# EAGLE schematic schematico- matteo (EAGLE 9.2.2)

## Sheet 1 of 3
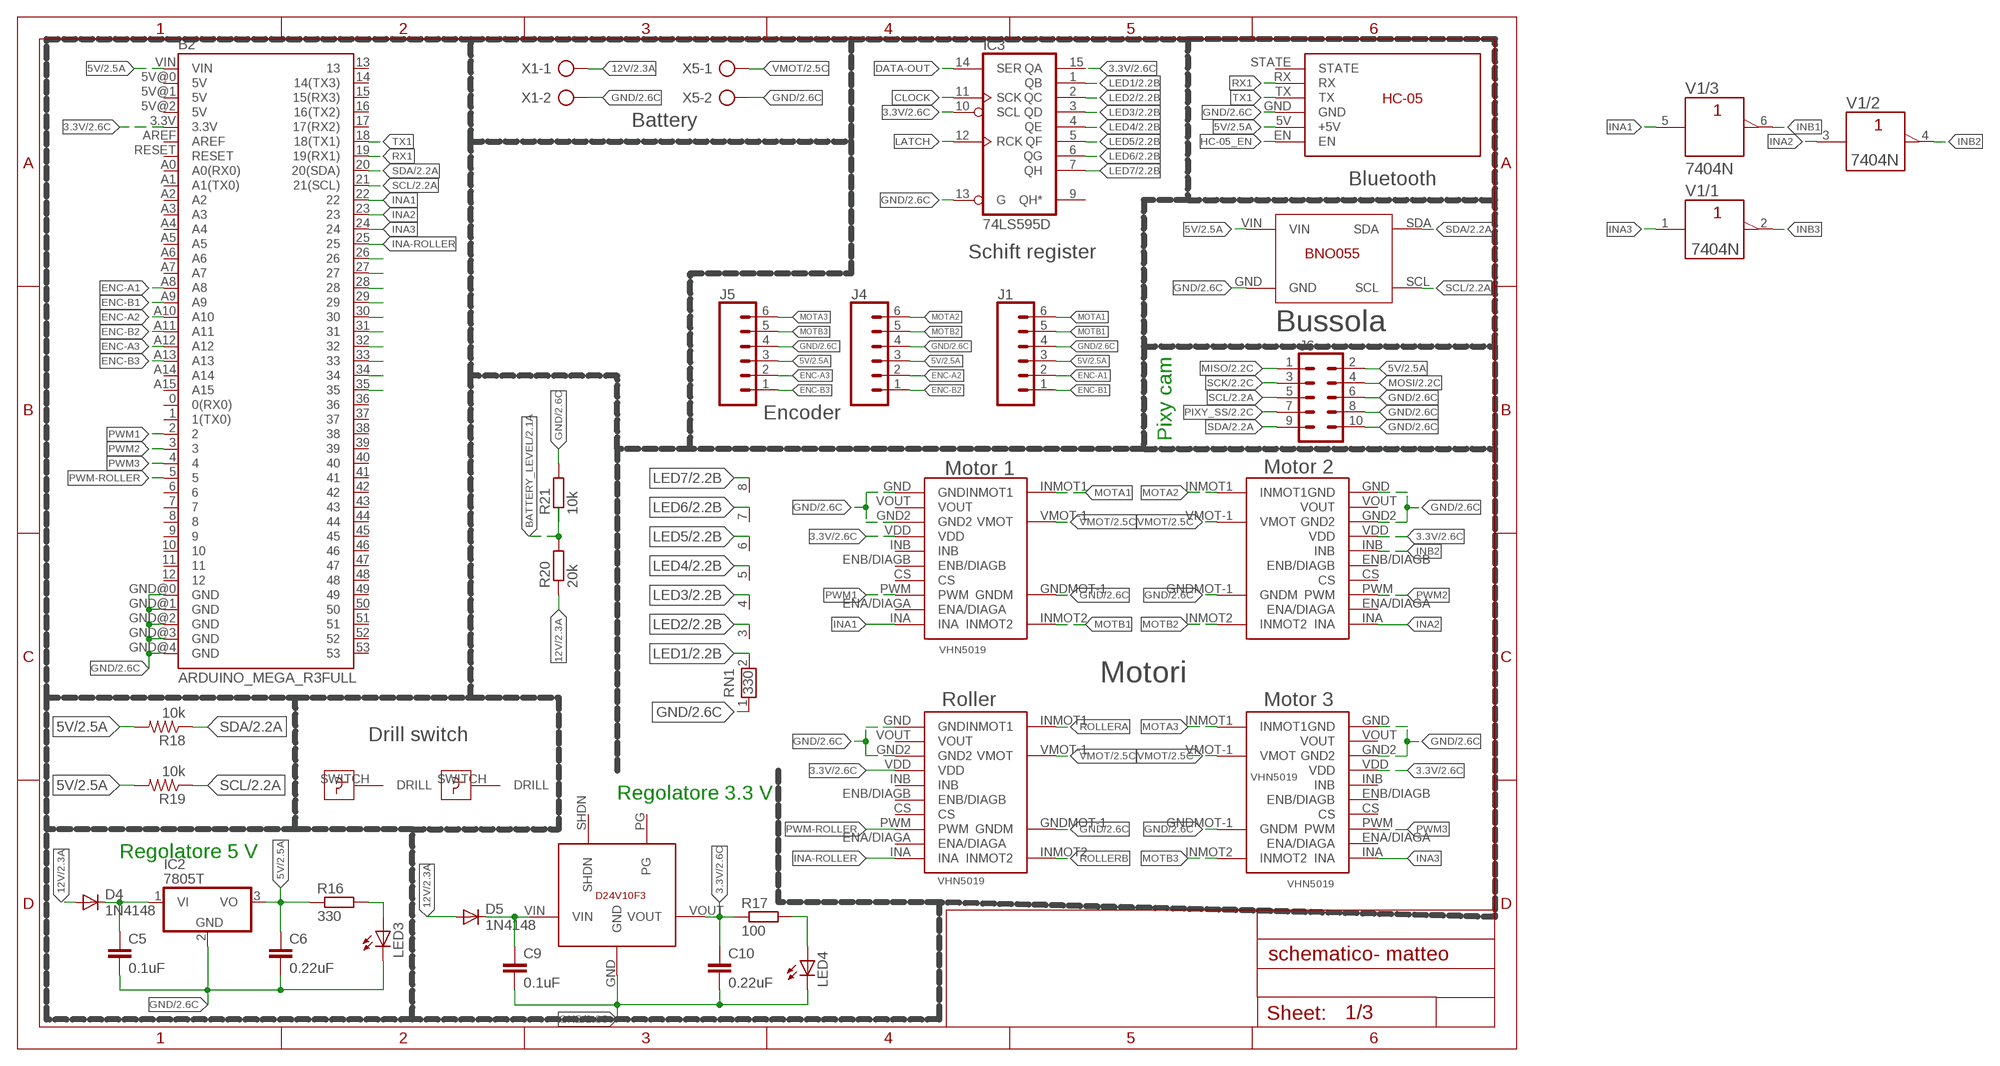
[diagram p0: schematic, sheet 1]

### Parts
B2  ARDUINO_MEGA_R3FULL  [ARDUINO_MEGA]
C5  0.1uF  0.1UF-KIT-EZ-50V-20%  [CAP-PTH-SMALL-KIT]
C6  0.22uF  0.1UF-KIT-EZ-50V-20%  [CAP-PTH-SMALL-KIT]
C9  0.1uF  0.1UF-KIT-EZ-50V-20%  [CAP-PTH-SMALL-KIT]
C10  0.22uF  0.1UF-KIT-EZ-50V-20%  [CAP-PTH-SMALL-KIT]
D4  1N4148  1N4148DO35-7  [DO35-7]
D5  1N4148  1N4148DO35-7  [DO35-7]
IC2  7805T  [TO220H]
IC3  74LS595D  [SO16]
J1  CONN_06SILK_FEMALE_PTH  [1X06]
J4  CONN_06SILK_FEMALE_PTH  [1X06]
J5  CONN_06SILK_FEMALE_PTH  [1X06]
J6  CONN_05X2PTH  [2X5]
LED3  TLLR4400  [LED3MM]
LED4  TLLR4400  [LED3MM]
R16  330  R0204/7  [0204/7]
R17  100  R0204/7  [0204/7]
R18  10k  R-US_M1206  [M1206]
R19  10k  R-US_M1206  [M1206]
R20  20k  R0204/7  [0204/7]
R21  10k  R0204/7  [0204/7]
RN1  330  RN07  [RN-8]
U$1  DRILL_SWITCH  [DRILL_SWITCH]
U$2  DRILL_SWITCH  [DRILL_SWITCH]
U$4  VHN5019  [MOTOR-SHIELD]
U$5  VHN5019  [MOTOR-SHIELD]
U$6  VHN5019  [MOTOR-SHIELD]
U$7  VHN5019  [MOTOR-SHIELD]
U$17  BNO055  [BNO005]
U$18  HC-05  [HC-05]
U$19  STEPDOWN_D24V10F3  [STEPDOWN_D24V10F3]
V1  7404N  [DIL14]
X1  AK500/2-H  [AK500/2-H]
X5  AK500/2-H  [AK500/2-H]

### Nets
3.3V: B2.3.3V C10.1 IC3.10(SCL) IC3.15(QA) R17.1 U$4.VDD U$5.VDD U$6.VDD U$7.VDD U$19.VOUT ; also sheet 2,3
5V: B2.VIN C6.1 IC2.3(VO) J1.3 J4.3 J5.3 J6.2 R16.1 R18.2 R19.2 U$17.VIN U$18.5V(+5V) ; also sheet 2,3
12V: C5.1 D4.A D4.C D5.A IC2.1(VI) R20.1 X1.1 ; also sheet 2,3
BATTERY_LEVEL: R20.2 R21.1 ; also sheet 2,3
CLOCK: IC3.11(SCK)
DATA-OUT: IC3.14(SER)
ENC-A1: B2.A8 J1.2
ENC-A2: B2.A10 J4.2
ENC-A3: B2.A12 J5.2
ENC-B1: B2.A9 J1.1
ENC-B2: B2.A11 J4.1
ENC-B3: B2.A13 J5.1
GND: B2.GND@0(GND) B2.GND@1(GND) B2.GND@2(GND) B2.GND@3(GND) B2.GND@4(GND) C5.2 C6.2 C9.2 C10.2 IC2.2(GND) IC3.13(G) J1.4 J4.4 J5.4 J6.6 J6.8 J6.10 LED3.K(C) LED4.K(C) R21.2 RN1.1 U$4.GND U$4.GND2 U$4.GNDMOT-1(GNDM) U$5.GND U$5.GND2 U$5.GNDMOT-1(GNDM) U$6.GND U$6.GND2 U$6.GNDMOT-1(GNDM) U$7.GND U$7.GND2 U$7.GNDMOT-1(GNDM) U$17.GND U$18.GND U$19.GND X1.2 X5.2 ; also sheet 2,3
HC-05_EN: U$18.EN
INA1: B2.22 U$4.INA V1.5(/3:A)
INA2: B2.23 U$5.INA V1.3(/2:A)
INA3: B2.24 U$6.INA V1.1(/1:A)
INA-ROLLER: B2.25 U$7.INA
INB1: V1.6(/3:Y)
INB2: U$5.INB V1.4(/2:Y)
INB3: V1.2(/1:Y)
LATCH: IC3.12(RCK)
LED1: IC3.1(QB) RN1.2 ; also sheet 2,3
LED2: IC3.2(QC) RN1.3 ; also sheet 2,3
LED3: IC3.3(QD) RN1.4 ; also sheet 2,3
LED4: IC3.4(QE) RN1.5 ; also sheet 2,3
LED5: IC3.5(QF) RN1.6 ; also sheet 2,3
LED6: IC3.6(QG) RN1.7 ; also sheet 2,3
LED7: IC3.7(QH) RN1.8 ; also sheet 2,3
MISO: J6.1 ; also sheet 2,3
MOSI: J6.4 ; also sheet 2,3
MOTA1: J1.6 U$4.INMOT1
MOTA2: J4.6 U$5.INMOT1
MOTA3: J5.6 U$6.INMOT1
MOTB1: J1.5 U$4.INMOT2
MOTB2: J4.5 U$5.INMOT2
MOTB3: J5.5 U$6.INMOT2
N$1: LED3.A R16.2
N$6: C9.1 D5.C U$19.VIN
N$7: B2.26
N$21: LED4.A R17.2
N$22: B2.27
N$26: B2.28
N$27: B2.29
N$28: B2.30
N$29: B2.31
N$30: B2.32
N$31: B2.33
N$32: B2.34
N$33: B2.35
PIXY_SS: J6.7 ; also sheet 2,3
PWM1: B2.2 U$4.PWM
PWM2: B2.3 U$5.PWM
PWM3: B2.4 U$6.PWM
PWM-ROLLER: B2.5 U$7.PWM
ROLLERA: U$7.INMOT1
ROLLERB: U$7.INMOT2
RX1: B2.19(19(RX1)) U$18.RX
SCK: J6.3 ; also sheet 2,3
SCL: B2.21(21(SCL)) J6.5 R19.1 U$17.SCL ; also sheet 2,3
SDA: B2.20(20(SDA)) J6.9 R18.1 U$17.SDA ; also sheet 2,3
TX1: B2.18(18(TX1)) U$18.TX
VMOT: U$4.VMOT-1(VMOT) U$5.VMOT-1(VMOT) U$6.VMOT-1(VMOT) U$7.VMOT-1(VMOT) X5.1 ; also sheet 2,3
Unconnected: B2.0(0(RX0)) B2.1(1(TX0)) B2.5V@0(5V) B2.5V@1(5V) B2.5V@2(5V) B2.6 B2.7 B2.8 B2.9 B2.10 B2.11 B2.12 B2.13 B2.14(14(TX3)) B2.15(15(RX3)) B2.16(16(TX2)) B2.17(17(RX2)) B2.36 B2.37 B2.38 B2.39 B2.40 B2.41 B2.42 B2.43 B2.44 B2.45 B2.46 B2.47 B2.48 B2.49 B2.50 B2.51 B2.52 B2.53 B2.A0(A0(RX0)) B2.A1(A1(TX0)) B2.A2 B2.A3 B2.A4 B2.A5 B2.A6 B2.A7 B2.A14 B2.A15 B2.AREF B2.RESET IC3.9(QH*) U$1.SWITCH(DRILL) U$2.SWITCH(DRILL) U$4.CS U$4.ENA/DIAGA U$4.ENB/DIAGB U$4.INB U$4.VOUT U$5.CS U$5.ENA/DIAGA U$5.ENB/DIAGB U$5.VOUT U$6.CS U$6.ENA/DIAGA U$6.ENB/DIAGB U$6.INB U$6.VOUT U$7.CS U$7.ENA/DIAGA U$7.ENB/DIAGB U$7.INB U$7.VOUT U$18.STATE U$19.PG U$19.SHDN V1.8(/4:Y) V1.9(/4:A) V1.10(/5:Y) V1.11(/5:A) V1.12(/6:Y) V1.13(/6:A)

### Notes on the sheet
- Battery
- Bluetooth
- Schift register
- Bussola
- Pixy cam
- Encoder
- Motor 1 | Motor 2
- Motori
- Roller | Motor 3
- Drill switch
- Regolatore 3.3 V
- Regolatore 5 V

## Sheet 2 of 3
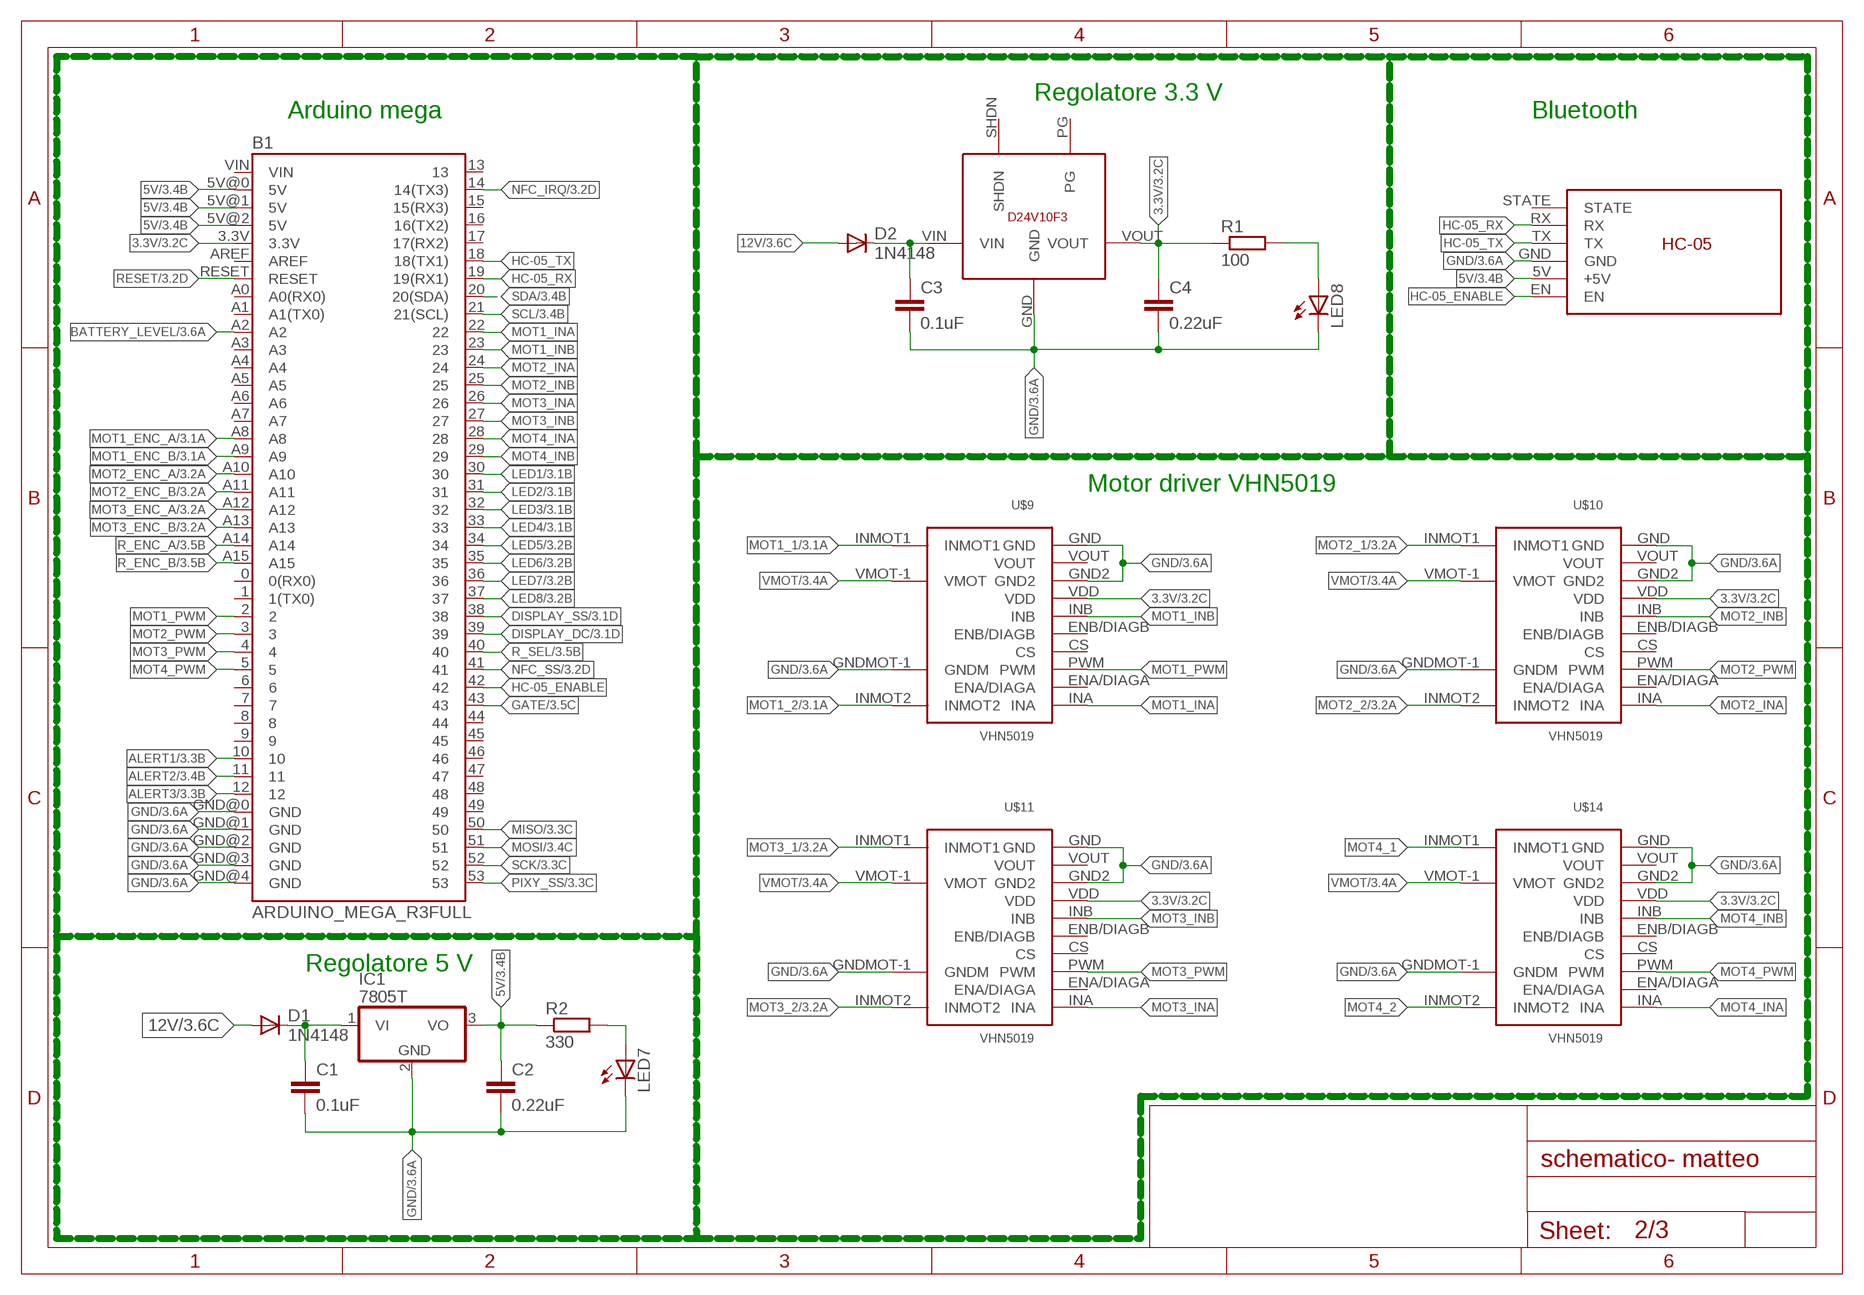
[diagram p1: schematic, sheet 2]

### Parts
B1  ARDUINO_MEGA_R3FULL  [ARDUINO_MEGA]
C1  0.1uF  0.1UF-KIT-EZ-50V-20%  [CAP-PTH-SMALL-KIT]
C2  0.22uF  0.1UF-KIT-EZ-50V-20%  [CAP-PTH-SMALL-KIT]
C3  0.1uF  0.1UF-KIT-EZ-50V-20%  [CAP-PTH-SMALL-KIT]
C4  0.22uF  0.1UF-KIT-EZ-50V-20%  [CAP-PTH-SMALL-KIT]
D1  1N4148  1N4148DO35-7  [DO35-7]
D2  1N4148  1N4148DO35-7  [DO35-7]
IC1  7805T  [TO220H]
LED7  TLLR4400  [LED3MM]
LED8  TLLR4400  [LED3MM]
R1  100  R0204/7  [0204/7]
R2  330  R0204/7  [0204/7]
U$8  STEPDOWN_D24V10F3  [STEPDOWN_D24V10F3]
U$9  VHN5019  [MOTOR-SHIELD]
U$10  VHN5019  [MOTOR-SHIELD]
U$11  VHN5019  [MOTOR-SHIELD]
U$14  VHN5019  [MOTOR-SHIELD]
U$16  HC-05  [HC-05]

### Nets
3.3V: B1.3.3V C4.1 R1.1 U$8.VOUT U$9.VDD U$10.VDD U$11.VDD U$14.VDD ; also sheet 1,3
5V: B1.5V@0(5V) B1.5V@1(5V) B1.5V@2(5V) C2.1 IC1.3(VO) R2.1 U$16.5V(+5V) ; also sheet 1,3
12V: C1.1 D1.A D1.C D2.A IC1.1(VI) ; also sheet 1,3
ALERT1: B1.10 ; also sheet 3
ALERT2: B1.11 ; also sheet 3
ALERT3: B1.12 ; also sheet 3
BATTERY_LEVEL: B1.A2 ; also sheet 1,3
DISPLAY_DC: B1.39 ; also sheet 3
DISPLAY_SS: B1.38 ; also sheet 3
GATE: B1.43 ; also sheet 3
GND: B1.GND@0(GND) B1.GND@1(GND) B1.GND@2(GND) B1.GND@3(GND) B1.GND@4(GND) C1.2 C2.2 C3.2 C4.2 IC1.2(GND) LED7.K(C) LED8.K(C) U$8.GND U$9.GND U$9.GND2 U$9.GNDMOT-1(GNDM) U$10.GND U$10.GND2 U$10.GNDMOT-1(GNDM) U$11.GND U$11.GND2 U$11.GNDMOT-1(GNDM) U$14.GND U$14.GND2 U$14.GNDMOT-1(GNDM) U$16.GND ; also sheet 1,3
HC-05_ENABLE: B1.42 U$16.EN
HC-05_RX: B1.19(19(RX1)) U$16.RX
HC-05_TX: B1.18(18(TX1)) U$16.TX
LED1: B1.30 ; also sheet 1,3
LED2: B1.31 ; also sheet 1,3
LED3: B1.32 ; also sheet 1,3
LED4: B1.33 ; also sheet 1,3
LED5: B1.34 ; also sheet 1,3
LED6: B1.35 ; also sheet 1,3
LED7: B1.36 ; also sheet 1,3
LED8: B1.37 ; also sheet 3
MISO: B1.50 ; also sheet 1,3
MOSI: B1.51 ; also sheet 1,3
MOT1_1: U$9.INMOT1 ; also sheet 3
MOT1_2: U$9.INMOT2 ; also sheet 3
MOT1_ENC_A: B1.A8 ; also sheet 3
MOT1_ENC_B: B1.A9 ; also sheet 3
MOT1_INA: B1.22 U$9.INA
MOT1_INB: B1.23 U$9.INB
MOT1_PWM: B1.2 U$9.PWM
MOT2_1: U$10.INMOT1 ; also sheet 3
MOT2_2: U$10.INMOT2 ; also sheet 3
MOT2_ENC_A: B1.A10 ; also sheet 3
MOT2_ENC_B: B1.A11 ; also sheet 3
MOT2_INA: B1.24 U$10.INA
MOT2_INB: B1.25 U$10.INB
MOT2_PWM: B1.3 U$10.PWM
MOT3_1: U$11.INMOT1 ; also sheet 3
MOT3_2: U$11.INMOT2 ; also sheet 3
MOT3_ENC_A: B1.A12 ; also sheet 3
MOT3_ENC_B: B1.A13 ; also sheet 3
MOT3_INA: B1.26 U$11.INA
MOT3_INB: B1.27 U$11.INB
MOT3_PWM: B1.4 U$11.PWM
MOT4_1: U$14.INMOT1
MOT4_2: U$14.INMOT2
MOT4_INA: B1.28 U$14.INA
MOT4_INB: B1.29 U$14.INB
MOT4_PWM: B1.5 U$14.PWM
N$9: LED7.A R2.2
N$10: C3.1 D2.C U$8.VIN
N$11: LED8.A R1.2
NFC_IRQ: B1.14(14(TX3)) ; also sheet 3
NFC_SS: B1.41 ; also sheet 3
PIXY_SS: B1.53 ; also sheet 1,3
R_ENC_A: B1.A14 ; also sheet 3
R_ENC_B: B1.A15 ; also sheet 3
R_SEL: B1.40 ; also sheet 3
RESET: B1.RESET ; also sheet 3
SCK: B1.52 ; also sheet 1,3
SCL: B1.21(21(SCL)) ; also sheet 1,3
SDA: B1.20(20(SDA)) ; also sheet 1,3
VMOT: U$9.VMOT-1(VMOT) U$10.VMOT-1(VMOT) U$11.VMOT-1(VMOT) U$14.VMOT-1(VMOT) ; also sheet 1,3
Unconnected: B1.0(0(RX0)) B1.1(1(TX0)) B1.6 B1.7 B1.8 B1.9 B1.13 B1.15(15(RX3)) B1.16(16(TX2)) B1.17(17(RX2)) B1.44 B1.45 B1.46 B1.47 B1.48 B1.49 B1.A0(A0(RX0)) B1.A1(A1(TX0)) B1.A3 B1.A4 B1.A5 B1.A6 B1.A7 B1.AREF B1.VIN U$8.PG U$8.SHDN U$9.CS U$9.ENA/DIAGA U$9.ENB/DIAGB U$9.VOUT U$10.CS U$10.ENA/DIAGA U$10.ENB/DIAGB U$10.VOUT U$11.CS U$11.ENA/DIAGA U$11.ENB/DIAGB U$11.VOUT U$14.CS U$14.ENA/DIAGA U$14.ENB/DIAGB U$14.VOUT U$16.STATE

### Notes on the sheet
- Regolatore 3.3 V
- Arduino mega | Bluetooth
- Motor driver VHN5019
- Regolatore 5 V

## Sheet 3 of 3
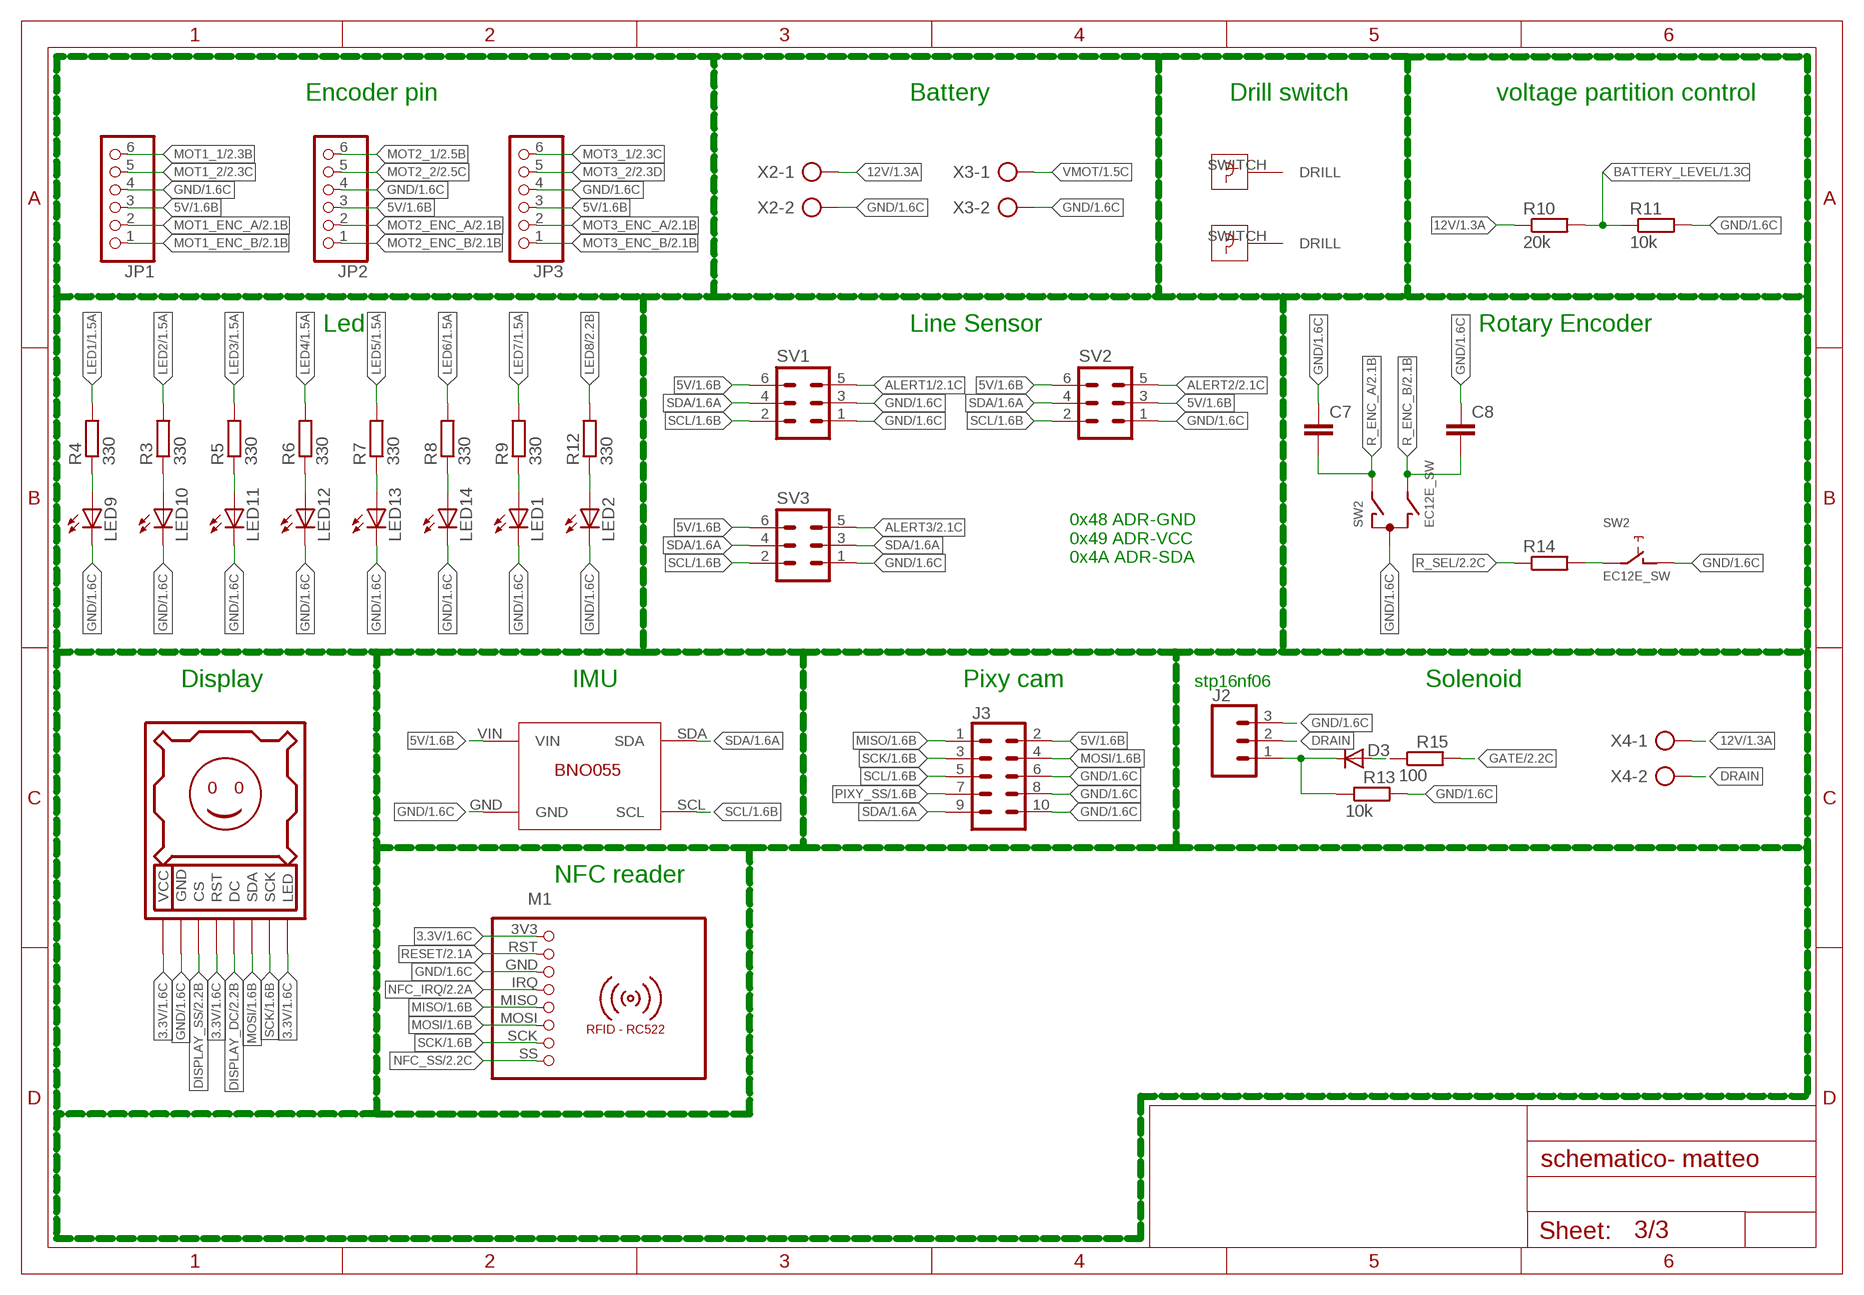
[diagram p2: schematic, sheet 3]

### Parts
C7  C-EUC1206  [C1206]
C8  C-EUC1206  [C1206]
D3  1N4148  1N4148DO35-7  [DO35-7]
DISPLAY1  DISPLAY128X128  [DISPLAY128X128]
J2  455-1750-1-ND  CONN_03  [1X03]
J3  CONN_05X2PTH  [2X5]
JP1  PINHD-1X6  [1X06]
JP2  PINHD-1X6  [1X06]
JP3  PINHD-1X6  [1X06]
LED1  TLLG4400  [LED3MM]
LED2  TLLG4400  [LED3MM]
LED9  TLLG4400  [LED3MM]
LED10  TLLG4400  [LED3MM]
LED11  TLLG4400  [LED3MM]
LED12  TLLG4400  [LED3MM]
LED13  TLLG4400  [LED3MM]
LED14  TLLG4400  [LED3MM]
M1  RFID-RC522  [RFID-RC522]
R3  330  RR1206  [R1206]
R4  330  RR1206  [R1206]
R5  330  RR1206  [R1206]
R6  330  RR1206  [R1206]
R7  330  RR1206  [R1206]
R8  330  RR1206  [R1206]
R9  330  RR1206  [R1206]
R10  20k  R0204/7  [0204/7]
R11  10k  R0204/7  [0204/7]
R12  330  RR1206  [R1206]
R13  10k  RR1206  [R1206]
R14  R-EU_M1206  [M1206]
R15  100  RR1206  [R1206]
SV1  MA03-2  [MA03-2]
SV2  MA03-2  [MA03-2]
SV3  MA03-2  [MA03-2]
SW2  EC12E_SW  [ALPS_EC12E_SW]
U$12  DRILL_SWITCH  [DRILL_SWITCH]
U$13  DRILL_SWITCH  [DRILL_SWITCH]
U$15  BNO055  [BNO005]
X2  AK500/2-H  [AK500/2-H]
X3  AK500/2-H  [AK500/2-H]
X4  AK500/2-H  [AK500/2-H]

### Nets
3.3V: DISPLAY1.LED DISPLAY1.RST DISPLAY1.VCC M1.3V3 ; also sheet 1,2
5V: J3.2 JP1.3 JP2.3 JP3.3 SV1.6 SV2.3 SV2.6 SV3.6 U$15.VIN ; also sheet 1,2
12V: R10.1 X2.1 X4.1 ; also sheet 1,2
ALERT1: SV1.5 ; also sheet 2
ALERT2: SV2.5 ; also sheet 2
ALERT3: SV3.5 ; also sheet 2
BATTERY_LEVEL: R10.2 R11.1 ; also sheet 1,2
DISPLAY_DC: DISPLAY1.DC ; also sheet 2
DISPLAY_SS: DISPLAY1.CS ; also sheet 2
DRAIN: J2.2 X4.2
GATE: R15.2 ; also sheet 2
GND: C7.1 C8.1 DISPLAY1.GND J2.3 J3.6 J3.8 J3.10 JP1.4 JP2.4 JP3.4 LED1.K(C) LED2.K(C) LED9.K(C) LED10.K(C) LED11.K(C) LED12.K(C) LED13.K(C) LED14.K(C) M1.GND R11.2 R13.2 SV1.1 SV1.3 SV2.1 SV3.1 SW2.C SW2.D U$15.GND X2.2 X3.2 ; also sheet 1,2
LED1: R4.2 ; also sheet 1,2
LED2: R3.2 ; also sheet 1,2
LED3: R5.2 ; also sheet 1,2
LED4: R6.2 ; also sheet 1,2
LED5: R7.2 ; also sheet 1,2
LED6: R8.2 ; also sheet 1,2
LED7: R9.2 ; also sheet 1,2
LED8: R12.2 ; also sheet 2
MISO: J3.1 M1.MISO ; also sheet 1,2
MOSI: DISPLAY1.SDA J3.4 M1.MOSI ; also sheet 1,2
MOT1_1: JP1.6 ; also sheet 2
MOT1_2: JP1.5 ; also sheet 2
MOT1_ENC_A: JP1.2 ; also sheet 2
MOT1_ENC_B: JP1.1 ; also sheet 2
MOT2_1: JP2.6 ; also sheet 2
MOT2_2: JP2.5 ; also sheet 2
MOT2_ENC_A: JP2.2 ; also sheet 2
MOT2_ENC_B: JP2.1 ; also sheet 2
MOT3_1: JP3.6 ; also sheet 2
MOT3_2: JP3.5 ; also sheet 2
MOT3_ENC_A: JP3.2 ; also sheet 2
MOT3_ENC_B: JP3.1 ; also sheet 2
N$13: LED9.A R4.1
N$14: LED10.A R3.1
N$15: LED11.A R5.1
N$16: LED12.A R6.1
N$17: LED13.A R7.1
N$18: LED14.A R8.1
N$19: D3.C J2.1 R13.1
N$20: D3.A R15.1
N$23: LED1.A R9.1
N$24: LED2.A R12.1
N$25: R14.2 SW2.E
NFC_IRQ: M1.IRQ ; also sheet 2
NFC_SS: M1.SS ; also sheet 2
PIXY_SS: J3.7 ; also sheet 1,2
R_ENC_A: C7.2 SW2.A ; also sheet 2
R_ENC_B: C8.2 SW2.B ; also sheet 2
R_SEL: R14.1 ; also sheet 2
RESET: M1.RST ; also sheet 2
SCK: DISPLAY1.SCK J3.3 M1.SCK ; also sheet 1,2
SCL: J3.5 SV1.2 SV2.2 SV3.2 U$15.SCL ; also sheet 1,2
SDA: J3.9 SV1.4 SV2.4 SV3.3 SV3.4 U$15.SDA ; also sheet 1,2
VMOT: X3.1 ; also sheet 1,2
Unconnected: SW2.GND1(G) SW2.GND2(G) U$12.SWITCH(DRILL) U$13.SWITCH(DRILL)

### Notes on the sheet
- Encoder pin | Battery | Drill switch | voltage partition control
- Led | Line Sensor | Rotary Encoder
- 0x48 ADR-GND
  0x49 ADR-VCC
  0x4A ADR-SDA
- Display | IMU | Pixy cam | stp16nf06 | Solenoid
- NFC reader

## Power pins joined to a net without a drawn wire
+UB: V1.14(/+UB:+UB)
-UB: V1.7(/-UB:-UB)
GND: IC3.8(GND)
VCC: IC3.16(VCC)

## Library data of the parts
B1 B2 = SparkFun-Boards:ARDUINO_MEGA_R3: Arduino Mega R3 ATmega2560 R3 compatible footprint. SparkFun Products: Arduino Mega 2560 R3 <https://www.sparkfun.com/products/11061>
C1 C3 C5 C9 = SparkFun-Capacitors:0.1UF: 0.1µF ceramic capacitors A capacitor is a passive two-terminal electrical component used to store electrical energy temporarily in an electric field.; PROD_ID: CAP-08370
C2 C4 C6 C10 = SparkFun-Capacitors:0.1UF: 0.1µF ceramic capacitors A capacitor is a passive two-terminal electrical component used to store electrical energy temporarily in an electric field.; PROD_ID: CAP-08370; VALUE: 0.1uF
C7 C8 = rcl:C-EU: CAPACITOR, European symbol; SPICEPREFIX: C
D1-D5 = diode:1N4148: DIODE high speed (Philips)
DISPLAY1 = Display 128x128:DISPLAY128X128: LCD 1.44" Red Serial 128X128 SPI Color TFT LCD Display Module for Nokia 15XX Product information Description： 100% brand new and high quality 1.44-inch screen with SPI serial backplane module, a minimum of only four IO-driven resolution 128 * 128 Spike NOKIA 15XX, perfect upgrade true color Size: 1.44 inch SPI serial bus Resolution 128 * 128 Package Include:
IC1 IC2 = linear:78*: Positive VOLTAGE REGULATOR Source: http://cache.national.com/ds/LM/LM78L05.pdf http://www.fairchildsemi.com/ds/LM/LM7805.pdf
IC3 = 74xx-us:74*595: 8-bit SHIFT REGISTER, output latch
J1 J4 J5 = SparkFun-Connectors:CONN_06: Multi connection point. Often used as Generic Header-pin footprint for 0.1 inch spaced/style header connections On any of the 0.1 inch spaced packages, you can populate with these: Break Away Headers - Straight <https://www.sparkfun.com/products/116> (PRT-00116) Break Away Male Headers - Right Angle <https://www.sparkfun.com/products/553> (PRT-00553) Female Headers <https://www.sparkfun.com/products/115> (PRT-00115) Break Away Headers - Machine Pin <https://www.sparkfun.com/products/117> (PRT-00117) Break Away Female Headers - Swiss Machine Pin <https://www.sparkfun.com/products/743> (PRT-00743) Arduino Stackable Header - 6 Pin <https://www.sparkfun.com/products/9280> (PRT-09280) For SCREWTERMINALS and SPRING TERMINALS visit here: Screw Terimnals on SparkFun.com <https://www.sparkfun.com/search/results?term=Screw+Terminals> (5mm/3.5mm/2.54mm spacing) This device is also useful as a general connection point to wire up your design to another part of your project. Our various solder wires solder well into these plated through hole pads. Hook-Up Wire - Assortment (Stranded, 22 AWG) <https://www.sparkfun.com/products/11375> (PRT-11375) Hook-Up Wire - Assortment (Solid Core, 22 AWG) <https://www.sparkfun.com/products/11367> (PRT-11367) View the entire wire category on our website here <https://www.sparkfun.com/categories/141>; PROD_ID: CONN-08437
J2 = SparkFun-Connectors:CONN_03: Multi connection point. Often used as Generic Header-pin footprint for 0.1 inch spaced/style header connections On any of the 0.1 inch spaced packages, you can populate with these: Break Away Headers - Straight <https://www.sparkfun.com/products/116> (PRT-00116) Break Away Male Headers - Right Angle <https://www.sparkfun.com/products/553> (PRT-00553) Female Headers <https://www.sparkfun.com/products/115> (PRT-00115) Break Away Headers - Machine Pin <https://www.sparkfun.com/products/117> (PRT-00117) Break Away Female Headers - Swiss Machine Pin <https://www.sparkfun.com/products/743> (PRT-00743) Stackable Header - 3 Pin (Female, 0.1") <https://www.sparkfun.com/products/13875> (PRT-13875) For SCREWTERMINALS and SPRING TERMINALS visit here: Screw Terimnals on SparkFun.com <https://www.sparkfun.com/search/results?term=Screw+Terminals> (5mm/3.5mm/2.54mm spacing) This device is also useful as a general connection point to wire up your design to another part of your project. Our various solder wires solder well into these plated through hole pads. Hook-Up Wire - Assortment (Stranded, 22 AWG) <https://www.sparkfun.com/products/11375> (PRT-11375) Hook-Up Wire - Assortment (Solid Core, 22 AWG) <https://www.sparkfun.com/products/11367> (PRT-11367) View the entire wire category on our website here <https://www.sparkfun.com/categories/141> Special notes: Molex polarized connector foot print use with SKU : PRT-08232 with associated crimp pins and housings.; PROD_ID: XXX-00000
J3 J6 = SparkFun-Connectors:CONN_05X2: Multi connection point. Often used as Generic Header-pin footprint for 0.1 inch spaced/style header connections For AVR SPI programming port, see special device with nice symbol: "AVR_SPI_PROG_5x2.dev" You can populate with any combo of single row headers, but if you'd like an exact match, check these: 2x5 AVR ICSP Male Header <https://www.sparkfun.com/products/778> (PRT-00778) 2x5 Pin Shrouded Header <https://www.sparkfun.com/products/8506> (PRT-08506) On any of the 0.1 inch spaced packages, you can populate with these: Break Away Headers - Straight <https://www.sparkfun.com/products/116> (PRT-00116) Break Away Male Headers - Right Angle <https://www.sparkfun.com/products/553> (PRT-00553) Female Headers <https://www.sparkfun.com/products/115> (PRT-00115) Break Away Headers - Machine Pin <https://www.sparkfun.com/products/117> (PRT-00117) Break Away Female Headers - Swiss Machine Pin <https://www.sparkfun.com/products/743> (PRT-00743) Special note: the shrouded connector mates well with our 5x2 ribbon cables: 2x5 Pin IDC Ribbon Cable <https://www.sparkfun.com/products/8535> (PRT-08535); PROD_ID: CONN-08499; SF_ID: PRT-0778
JP1-JP3 = pinhead:PINHD-1X6: PIN HEADER
LED1 LED2 LED9-LED14 = led:TLLG4400: Low Current (2mA) LED 3 mm Tinted Diffused Package color GREEN Source: Data sheet <http://www.farnell.com/datasheets/391098.pdf>; MF: VISHAY SEMICONDUCTOR; OC_FARNELL: 1612435
LED3 LED4 LED7 LED8 = led:TLLR4400: Low Current (2mA) LED 3 mm Tinted Diffused Package color RED Source: Data sheet <http://www.farnell.com/datasheets/391100.pdf>; MF: VISHAY SEMICONDUCTOR; OC_FARNELL: 1612437
M1 = mfrc522-module:RFID-RC522: RFID-RC522 MFRC-522 based breakout board
R1-R13 R15-R17 R20 R21 = eagle-ltspice:R: RESISTOR, European symbol; SPICEMODEL: NONE; SPICEPREFIX: R
R14 = rcl:R-EU_: RESISTOR, European symbol; SPICEPREFIX: R
R18 R19 = resistor:R-US_: RESISTOR, American symbol
RN1 = resistor-net:RN07: RESISTOR NETWORK; OC_FARNELL: unknown; OC_NEWARK: unknown
SV1-SV3 = con-lstb:MA03-2: PIN HEADER; OC_FARNELL: unknown; OC_NEWARK: unknown
SW2 = switch-alps:EC12E_SW: ALPS rotary Encoder EC12E series with switch; MPN: EC12E2424407; OC_FARNELL: 1520813; OC_NEWARK: 74M1068
U$1 U$2 U$12 U$13 = Switch drill:DRILL_SWITCH: Switch per interruttore da 6mm diametro
U$4-U$7 U$9-U$11 U$14 = VHN5019:VHN5019: Operating voltage: 5.5 – 24 V1 Output current: 12 A continuous (30 maximum) 3V-compatible inputs PWM operation up to 20 kHz, which is ultrasonic and allows for quieter motor operation Current sense output proportional to motor current (approx. 140 mV/A) Motor indicator LEDs (indicates what the outputs are doing even when no motor is connected) Robust: Reverse-voltage protection Can survive input voltages up to 41 V Undervoltage and overvoltage shutdown High-side and low-side thermal shutdown Short-to-ground and short-to-Vcc protection; MOTOR: motor
U$8 U$19 = StepDown_ 3.3V_D24V10F3:STEPDOWN_D24V10F3: Step down pololu D24V10F3 da 12 V a 3.3V
U$15 U$17 = BNO055:BNO055: BNO055
U$16 U$18 = HC-05:HC-05
V1 = 74ttl-din:74*04: Hex INVERTER
X1-X5 = con-ptr500:AK500/2-H: CONNECTOR Aug. 2004 / PTR Meßtechnik: Die Bezeichnung der Serie AK505 wurde geändert. Es handelt sich hierbei um AK500 in horizontaler Ausführung.; OC_FARNELL: unknown; OC_NEWARK: unknown